# EAGLE design TeensyBreakout (EAGLE 7.3.0)
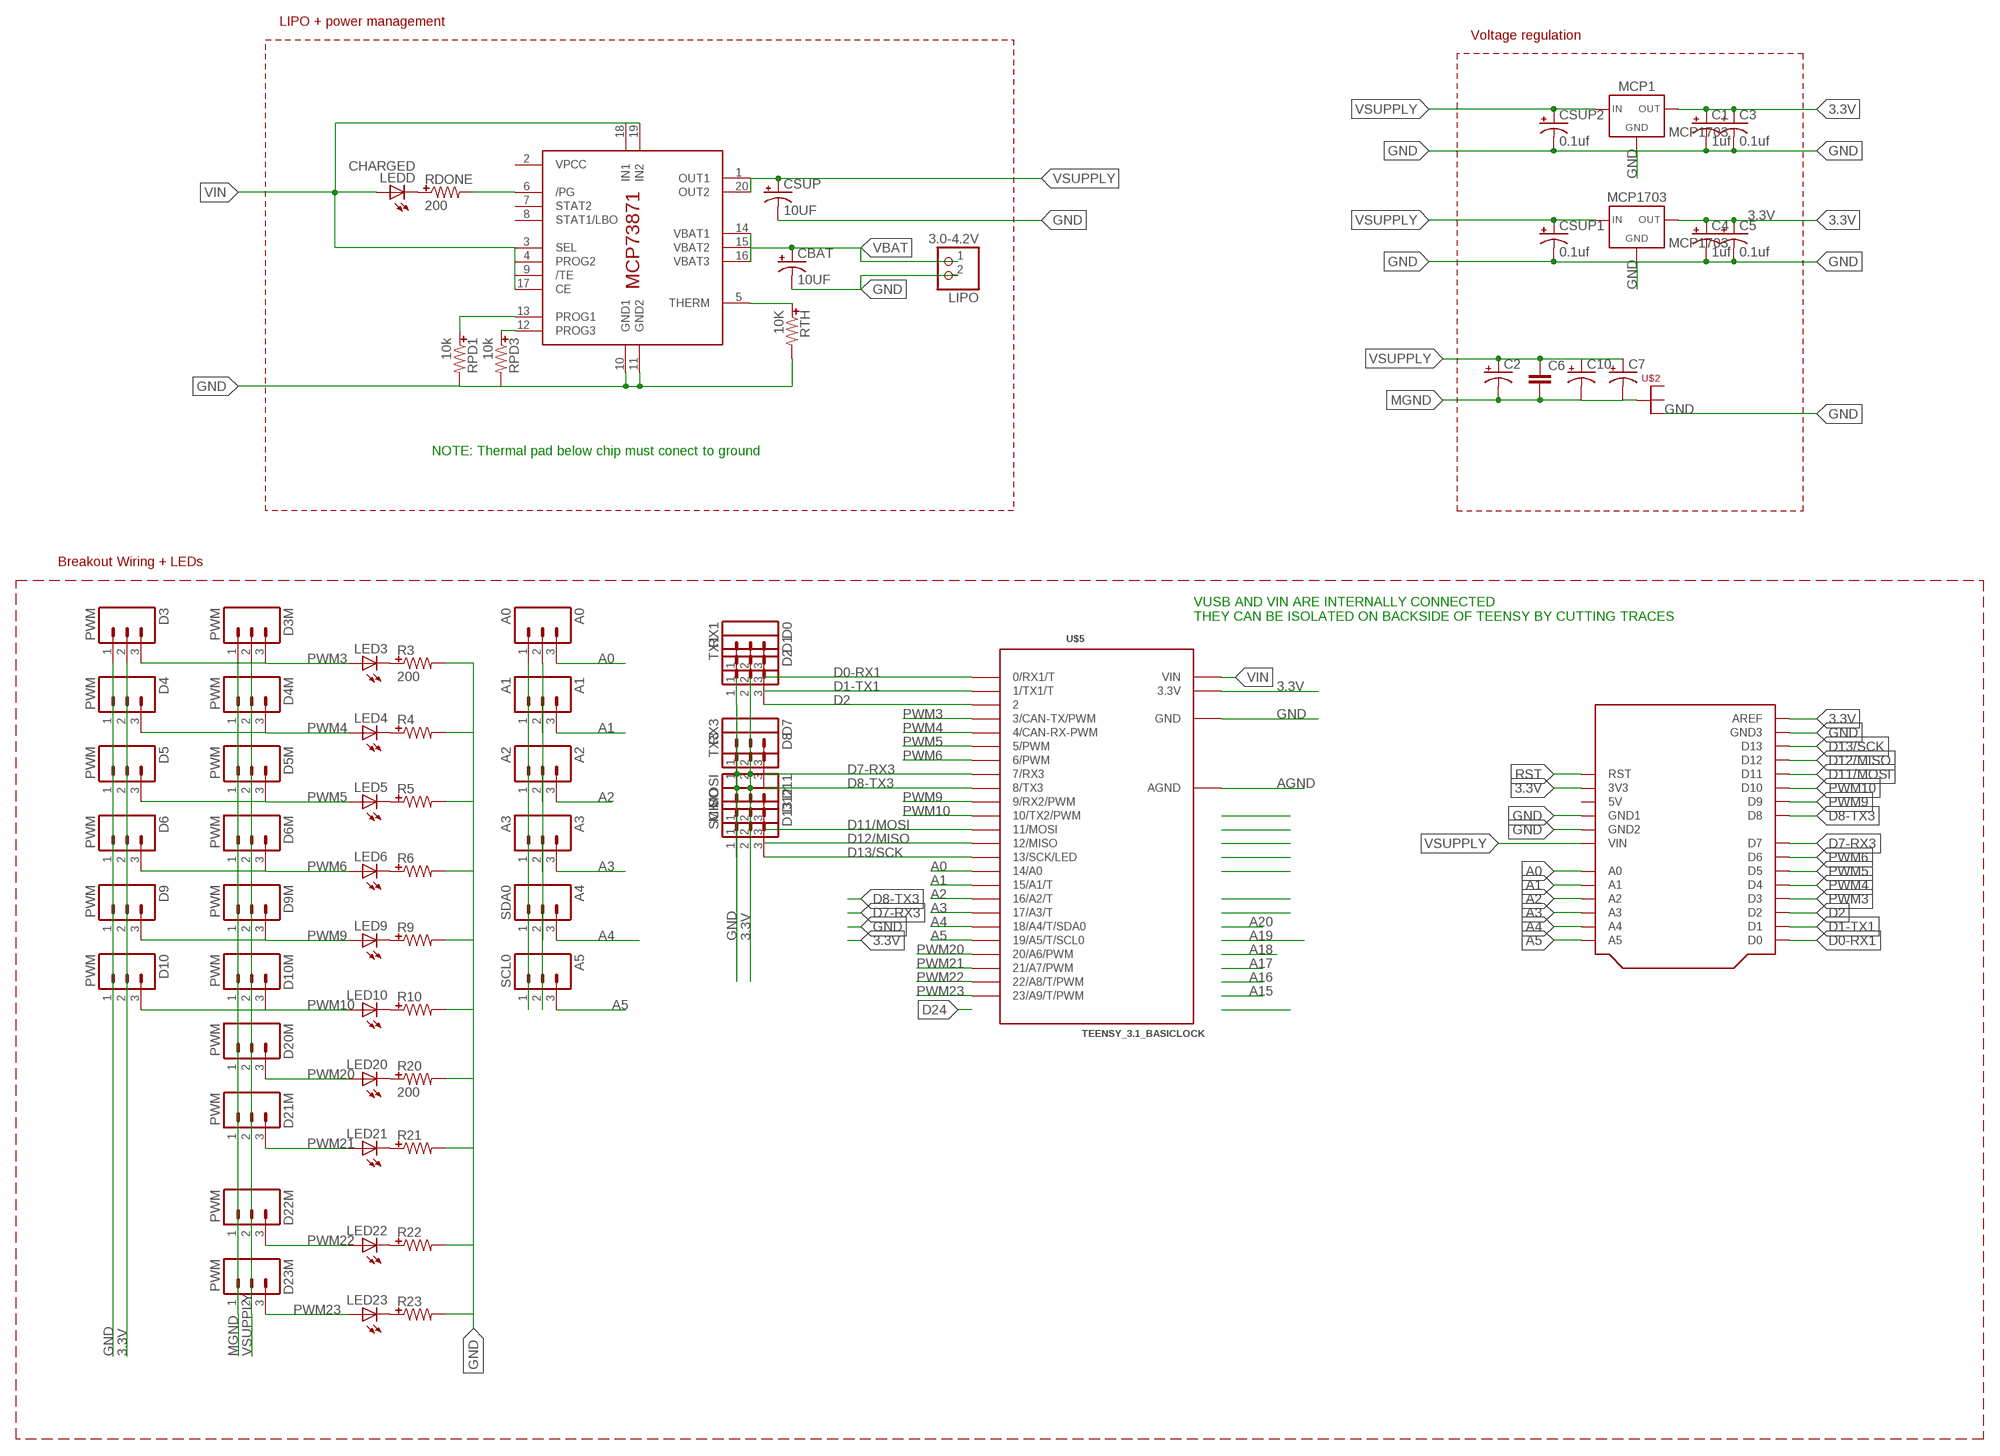
[diagram p0: schematic, sheet 1]

## Parts
A0  A0  M03LOCK  [1X03_LOCK]
A1  A1  M03LOCK  [1X03_LOCK]
A2  A2  M03LOCK  [1X03_LOCK]
A3  A3  M03LOCK  [1X03_LOCK]
A4  SDA0  M03LOCK  [1X03_LOCK]
A5  SCL0  M03LOCK  [1X03_LOCK]
C1  1uf  CAP-POLARIZEDUNIVERSAL  [0402-0603-0805-UNIVERSAL]
C2  CAP-POLARIZEDUNIVERSAL  [0402-0603-0805-UNIVERSAL]
C3  0.1uf  CAP-POLARIZEDUNIVERSAL  [0402-0603-0805-UNIVERSAL]
C4  1uf  CAP-POLARIZEDUNIVERSAL  [0402-0603-0805-UNIVERSAL]
C5  0.1uf  CAP-POLARIZEDUNIVERSAL  [0402-0603-0805-UNIVERSAL]
C6  CAP1210  [1210]
C7  CAP-POLARIZEDUNIVERSAL  [0402-0603-0805-UNIVERSAL]
C10  CAP-POLARIZEDUNIVERSAL  [0402-0603-0805-UNIVERSAL]
CBAT  10UF  CAP-POLARIZEDUNIVERSAL  [0402-0603-0805-UNIVERSAL]
CSUP  10UF  CAP-POLARIZEDUNIVERSAL  [0402-0603-0805-UNIVERSAL]
CSUP1  0.1uf  CAP-POLARIZEDUNIVERSAL  [0402-0603-0805-UNIVERSAL]
CSUP2  0.1uf  CAP-POLARIZEDUNIVERSAL  [0402-0603-0805-UNIVERSAL]
D0  RX1  M03LOCK  [1X03_LOCK]
D1  TX1  M03LOCK  [1X03_LOCK]
D2  M03LOCK  [1X03_LOCK]
D3  PWM  M03LOCK  [1X03_LOCK]
D3M  PWM  M03LOCK  [1X03_LOCK]
D4  PWM  M03LOCK  [1X03_LOCK]
D4M  PWM  M03LOCK  [1X03_LOCK]
D5  PWM  M03LOCK  [1X03_LOCK]
D5M  PWM  M03LOCK  [1X03_LOCK]
D6  PWM  M03LOCK  [1X03_LOCK]
D6M  PWM  M03LOCK  [1X03_LOCK]
D7  RX3  M03LOCK  [1X03_LOCK]
D8  TX3  M03LOCK  [1X03_LOCK]
D9  PWM  M03LOCK  [1X03_LOCK]
D9M  PWM  M03LOCK  [1X03_LOCK]
D10  PWM  M03LOCK  [1X03_LOCK]
D10M  PWM  M03LOCK  [1X03_LOCK]
D11  MOSI  M03LOCK  [1X03_LOCK]
D12  MISO  M03LOCK  [1X03_LOCK]
D13  SCK  M03LOCK  [1X03_LOCK]
D20M  PWM  M03LOCK  [1X03_LOCK]
D21M  PWM  M03LOCK  [1X03_LOCK]
D22M  PWM  M03LOCK  [1X03_LOCK]
D23M  PWM  M03LOCK  [1X03_LOCK]
IC1  MCP73871  [QFN20]
LED3  LEDUNIVERSAL  [0402-0603-0805-UNIVERSAL]
LED4  LEDUNIVERSAL  [0402-0603-0805-UNIVERSAL]
LED5  LEDUNIVERSAL  [0402-0603-0805-UNIVERSAL]
LED6  LEDUNIVERSAL  [0402-0603-0805-UNIVERSAL]
LED9  LEDUNIVERSAL  [0402-0603-0805-UNIVERSAL]
LED10  LEDUNIVERSAL  [0402-0603-0805-UNIVERSAL]
LED20  LEDUNIVERSAL  [0402-0603-0805-UNIVERSAL]
LED21  LEDUNIVERSAL  [0402-0603-0805-UNIVERSAL]
LED22  LEDUNIVERSAL  [0402-0603-0805-UNIVERSAL]
LED23  LEDUNIVERSAL  [0402-0603-0805-UNIVERSAL]
LEDD  CHARGED  LEDUNIVERSAL  [0402-0603-0805-UNIVERSAL]
LIPO  3.0-4.2V  JST_2PIN-THM-RA  [JST-PH-2-THM-RA]
MCP1  MCP1703  VOLTAGE-REGULATORMCP1703  [SOT23]
MCP1703  MCP1703  VOLTAGE-REGULATORMCP1703  [SOT23]
R3  200  RESISTORUNIVERSAL  [0402-0603-0805-UNIVERSAL]
R4  RESISTORUNIVERSAL  [0402-0603-0805-UNIVERSAL]
R5  RESISTORUNIVERSAL  [0402-0603-0805-UNIVERSAL]
R6  RESISTORUNIVERSAL  [0402-0603-0805-UNIVERSAL]
R9  RESISTORUNIVERSAL  [0402-0603-0805-UNIVERSAL]
R10  RESISTORUNIVERSAL  [0402-0603-0805-UNIVERSAL]
R20  200  RESISTORUNIVERSAL  [0402-0603-0805-UNIVERSAL]
R21  RESISTORUNIVERSAL  [0402-0603-0805-UNIVERSAL]
R22  RESISTORUNIVERSAL  [0402-0603-0805-UNIVERSAL]
R23  RESISTORUNIVERSAL  [0402-0603-0805-UNIVERSAL]
RDONE  200  RESISTORUNIVERSAL  [0402-0603-0805-UNIVERSAL]
RPD1  10k  RESISTORUNIVERSAL  [0402-0603-0805-UNIVERSAL]
RPD3  10k  RESISTORUNIVERSAL  [0402-0603-0805-UNIVERSAL]
RTH  10K  RESISTORUNIVERSAL  [0402-0603-0805-UNIVERSAL]
U$2  NET-JUNCTION8-MIL-DIAMETER  [NET-JUNCTION]
U$4  ARDUINO  [ARDUINO]
U$5  TEENSY_3.1_BASICLOCK  [TEENSY_3.1_BASIC_LOCK]

## Nets
3.3V: A0.2 A1.2 A2.2 A3.2 A4.2 A5.2 C1.+ C3.+ C4.+ C5.+ D0.2 D1.2 D2.2 D3.2 D4.2 D5.2 D6.2 D7.2 D8.2 D9.2 D10.2 D11.2 D12.2 D13.2 MCP1.2(OUT) MCP1703.2(OUT) U$4.3V3 U$4.AREF U$5.3.3V
A0: A0.3 U$4.A0 U$5.14/A0
A1: A1.3 U$4.A1 U$5.15/A1(15/A1/T)
A2: A2.3 U$4.A2 U$5.16/A2(16/A2/T)
A3: A3.3 U$4.A3 U$5.17/A3(17/A3/T)
A4: A4.3 U$4.A4 U$5.18/A4(18/A4/T/SDA0)
A5: A5.3 U$4.A5 U$5.19/A5(19/A5/T/SCL0)
AGND: U$5.AGND
D0-RX1: D0.3 U$4.D0 U$5.0(0/RX1/T)
D1-TX1: D1.3 U$4.D1 U$5.1(1/TX1/T)
D2: D2.3 U$4.D2 U$5.2
D7-RX3: D7.3 U$4.D7 U$5.7(7/RX3)
D8-TX3: D8.3 U$4.D8 U$5.8(8/TX3)
D11/MOSI: D11.3 U$4.D11 U$5.11(11/MOSI)
D12/MISO: D12.3 U$4.D12 U$5.12(12/MISO)
D13/SCK: D13.3 U$4.D13 U$5.13(13/SCK/LED)
GND: A0.1 A1.1 A2.1 A3.1 A4.1 A5.1 C1.- C3.- C4.- C5.- CBAT.- CSUP1.- CSUP2.- CSUP.- D0.1 D1.1 D2.1 D3.1 D4.1 D5.1 D6.1 D7.1 D8.1 D9.1 D10.1 D11.1 D12.1 D13.1 IC1.10(GND1) IC1.11(GND2) LIPO.2 MCP1.1(GND) MCP1703.1(GND) R3.- R4.- R5.- R6.- R9.- R10.- R20.- R21.- R22.- R23.- RPD1.- RPD3.- RTH.- U$2.P$4 U$4.GND1 U$4.GND2 U$4.GND3 U$5.GND
MGND: C2.- C6.2 C7.- C10.- D3M.1 D4M.1 D5M.1 D6M.1 D9M.1 D10M.1 D20M.1 D21M.1 D22M.1 D23M.1 U$2.P$1
N$1: IC1.5(THERM) RTH.+
N$2: IC1.12(PROG3) RPD3.+
N$4: IC1.13(PROG1) RPD1.+
N$6: IC1.6(/PG) RDONE.-
N$7: LEDD.-(C) RDONE.+
N$17: LED3.-(C) R3.+
N$18: LED4.-(C) R4.+
N$19: LED5.-(C) R5.+
N$20: LED6.-(C) R6.+
N$21: LED9.-(C) R9.+
N$22: LED10.-(C) R10.+
N$23: LED20.-(C) R20.+
N$24: LED21.-(C) R21.+
N$25: LED22.-(C) R22.+
N$26: LED23.-(C) R23.+
PWM3: D3.3 D3M.3 LED3.+(A) U$4.D3 U$5.3(3/CAN-TX/PWM)
PWM4: D4.3 D4M.3 LED4.+(A) U$4.D4 U$5.4(4/CAN-RX-PWM)
PWM5: D5.3 D5M.3 LED5.+(A) U$4.D5 U$5.5(5/PWM)
PWM6: D6.3 D6M.3 LED6.+(A) U$4.D6 U$5.6(6/PWM)
PWM9: D9.3 D9M.3 LED9.+(A) U$4.D9 U$5.9(9/RX2/PWM)
PWM10: D10.3 D10M.3 LED10.+(A) U$4.D10 U$5.10(10/TX2/PWM)
PWM20: D20M.3 LED20.+(A) U$5.20/A6(20/A6/PWM)
PWM21: D21M.3 LED21.+(A) U$5.21/A7(21/A7/PWM)
PWM22: D22M.3 LED22.+(A) U$5.22/A8(22/A8/T/PWM)
PWM23: D23M.3 LED23.+(A) U$5.23/A9(23/A9/T/PWM)
RST: U$4.RST
VBAT: CBAT.+ IC1.14(VBAT1) IC1.15(VBAT2) IC1.16(VBAT3) LIPO.1
VIN: IC1.3(SEL) IC1.4(PROG2) IC1.9(/TE) IC1.17(CE) IC1.18(IN1) IC1.19(IN2) LEDD.+(A) U$5.VIN
VSUPPLY: C2.+ C6.1 C7.+ C10.+ CSUP1.+ CSUP2.+ CSUP.+ D3M.2 D4M.2 D5M.2 D6M.2 D9M.2 D10M.2 D20M.2 D21M.2 D22M.2 D23M.2 IC1.1(OUT1) IC1.20(OUT2) MCP1.3(IN) MCP1703.3(IN) U$4.VIN
Unconnected: IC1.2(VPCC) IC1.7(STAT2) IC1.8(STAT1/LBO) U$2.P$3 U$2.P$5 U$4.5V

## Notes on the sheet
- LIPO + power management
- Voltage regulation
- NOTE: Thermal pad below chip must conect to ground
- Breakout Wiring + LEDs
- VUSB AND VIN ARE INTERNALLY CONNECTED
  THEY CAN BE ISOLATED ON BACKSIDE OF TEENSY BY CUTTING TRACES

## Library data of the parts
A0 A1-A5 D0 D1-D3 D3M D4 D4M D5 D5M D6 D6M D7-D9 D9M D10 D10M D11-D13 D20M D21M D22M D23M = tekdemo:M03: Header 3 Standard 3-pin 0.1" header. Use with straight break away headers (SKU : PRT-00116), right angle break away headers (PRT-00553), swiss pins (PRT-00743), machine pins (PRT-00117), and female headers (PRT-00115). Molex polarized connector foot print use with SKU : PRT-08232 with associated crimp pins and housings.
C1-C5 C7 C10 CBAT CSUP CSUP1 CSUP2 = tekdemo:CAP-POLARIZED: Capacitor Polarized These are standard SMD and PTH capacitors. Normally 10uF, 47uF, and 100uF in electrolytic and tantalum varieties. Always verify the external diameter of the through hole cap, it varies with capacity, voltage, and manufacturer. The EIA devices should be standard.
C6 = tekdemo:CAP: Capacitor Standard 0603 ceramic capacitor, and 0.1" leaded capacitor.
IC1 = adafruit:MCP73871
LED3-LED6 LED9 LED10 LED20-LED23 LEDD = tekdemo:LED: LEDs Standard schematic elements and footprints for 5mm, 3mm, 1206, and 0603 sized LEDs. 5mm - Spark Fun Electronics SKU : Comp-SBL
LIPO = adafruit:JST_2PIN: JST 2-Pin Connectors of various flavors SMT-RA (S2B-PH-SM4) 4UConnector #17311 SMT (B2B-PH-SM4) THM-RA (S2B-PH) THM (B2B-PH)
MCP1 MCP1703 = tekdemo:VOLTAGE-REGULATOR
R3-R6 R9 R10 R20-R23 RDONE RPD1 RPD3 RTH = tekdemo:RESISTOR: Resistor Basic schematic elements and footprints for 0603, 1206, and PTH resistors.
U$2 = tekdemo:NET-JUNCTION
U$4 = SMDuino:ARDUINO
U$5 = tekdemo:TEENSY_3.1_BASIC: Footprint for Teensy 3.1 board using all pin connections on the outer perimeter

## Board
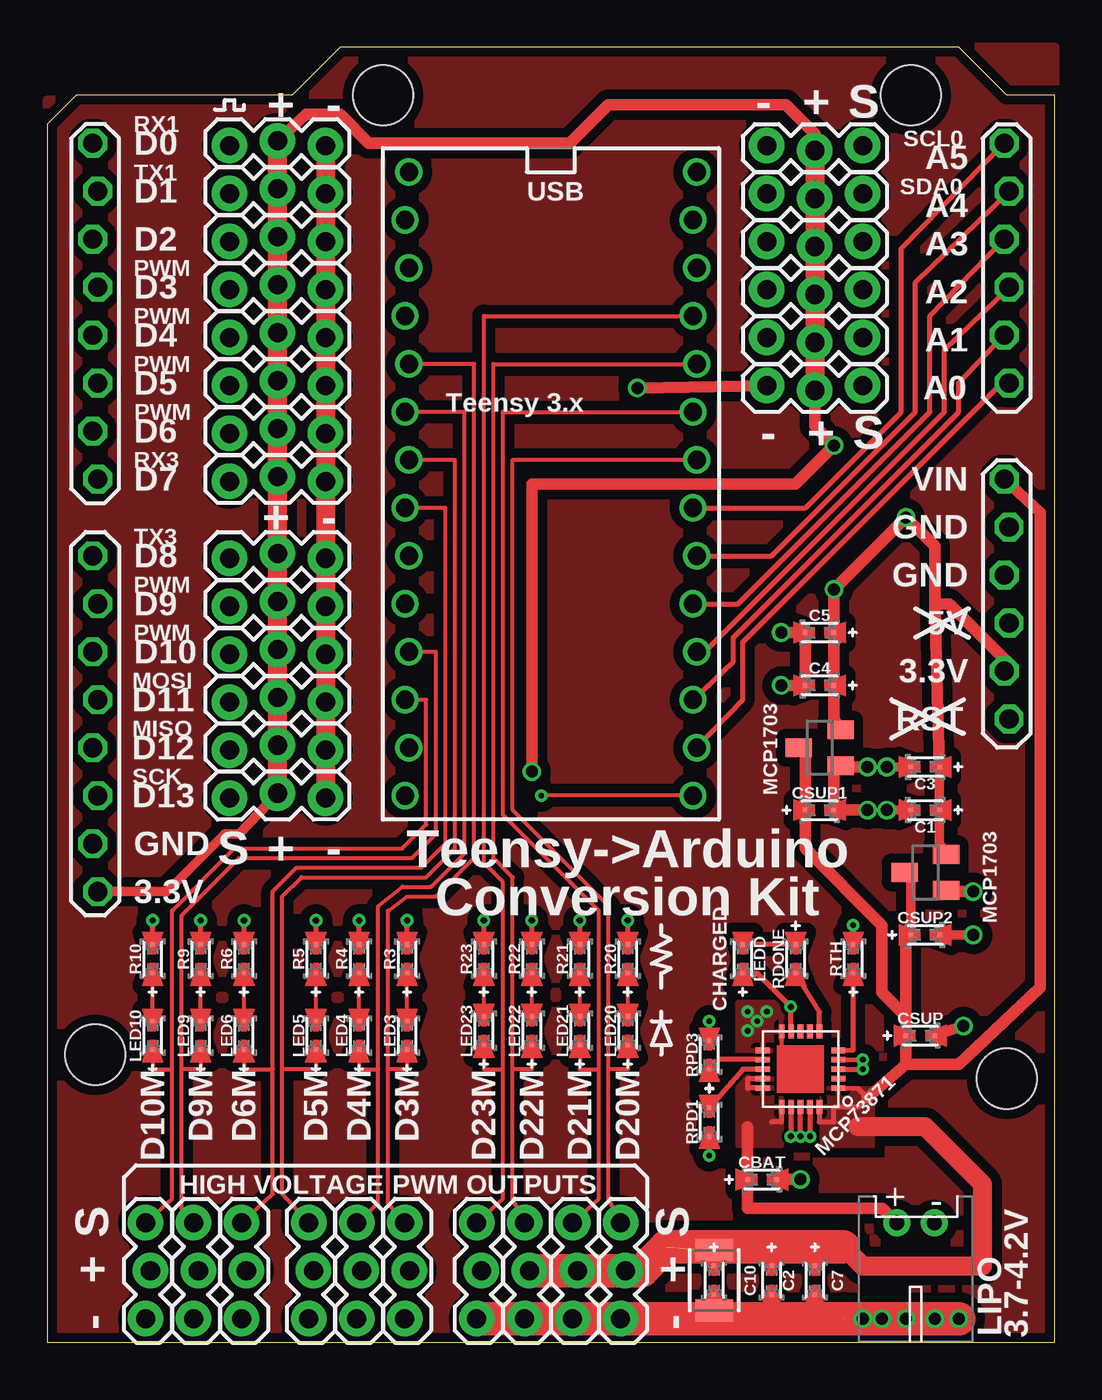
[diagram p1: board, top side]
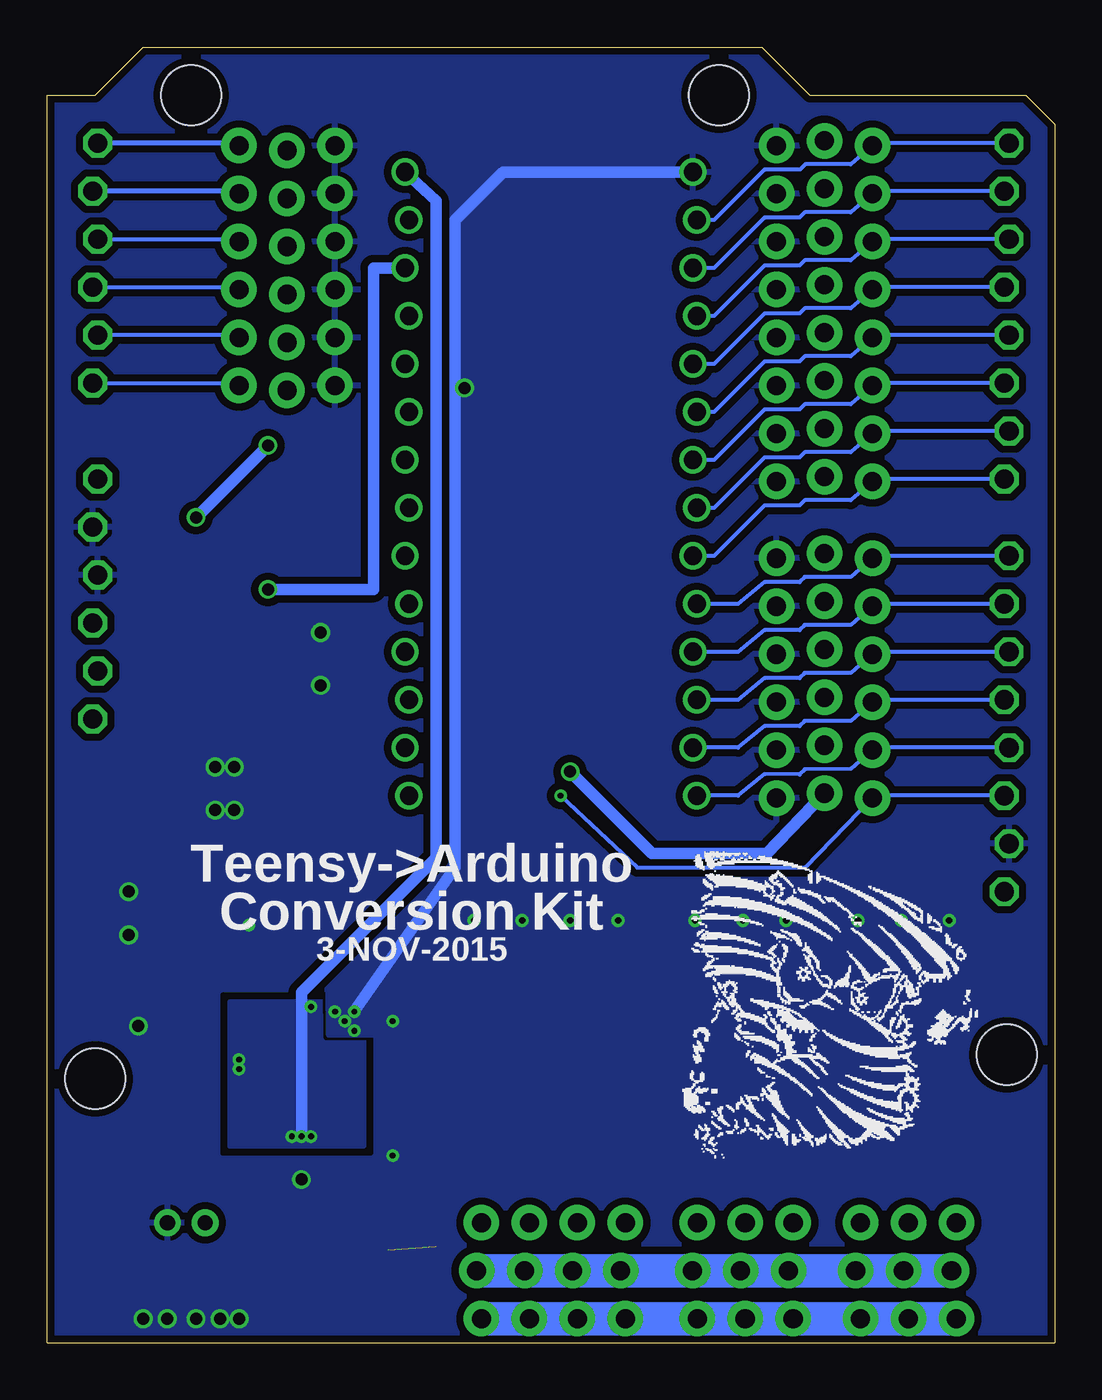
[diagram p2: board, bottom side, seen from below]

Size 53.34 x 68.58 mm. Coordinates in mm from the lower left corner, seen from the top.
Copper layers (1*16): Top 0.0356mm / dielectric 1.5011mm / Bottom 0.0356mm
Design rules "LaenPCBOrder-tented": minimum track width 6mil, minimum drill 13mil, track to track 6mil, track to pad 6mil, pad to pad 6mil, via to via 6mil, smd to smd 0mil, copper to edge 15mil, drill to drill 6mil, minimum pad ring 7mil, minimum via ring 7mil, stop-mask expansion 4mil, vias tented up to drill 25mil, thermal gap 10mil
tKeepout: area 47.6,10.8 to 54,17.1

### Footprints (pad centres in the part's own frame; a part is rotated, then mirrored left to right if it is on the bottom)
1X03_LOCK = drill 1.016 pad 1.88: 1 0,0.127; 2 2.54,-0.127; 3 5.08,0.127
0402-0603-0805-UNIVERSAL = smd 0.254 x 0.254: + -0.762,0; - 0.762,0
1210 = smd 1.2 x 2: 1 -1.6,0; 2 1.6,0
QFN20 = smd 0.75 x 0.3: 1 -2,1; 2 -2,0.5; 3 -2,0; 4 -2,-0.5; 5 -2,-1; 11 2,-1; 12 2,-0.5; 13 2,0; 14 2,0.5; 15 2,1 | smd 0.3 x 0.75: 6 -1,-2; 7 -0.5,-2; 8 0,-2; 9 0.5,-2; 10 1,-2; 16 1,2; 17 0.5,2; 18 0,2; 19 -0.5,2; 20 -1,2
JST-PH-2-THM-RA = drill 0.8 pad 1.422: 1 1,0; 2 -1,0
SOT23 = smd 1 x 1.4: 1 -0.95,-1.1; 2 0.95,-1.1; 3 0,1.1
NET-JUNCTION = smd 0.051 x 0.051: P$1 -0.076,0; P$3 0,0.076; P$4 0.076,0; P$5 0,-0.076
ARDUINO = drill 1.016 octagon: 3V3 35.56,2.667; 5V 38.1,2.413; A0 50.8,2.413; A1 53.34,2.667; A2 55.88,2.413; A3 58.42,2.667; A4 60.96,2.413; A5 63.5,2.667; AREF 23.876,50.673; D0 63.5,50.927; D1 60.96,50.673; D2 58.42,50.927; D3 55.88,50.673; D4 53.34,50.927; D5 50.8,50.673; D6 48.26,50.927; D7 45.72,50.673; D8 41.656,50.927; D9 39.116,50.673; D10 36.576,50.927; D11 34.036,50.673; D12 31.496,50.927; D13 28.956,50.673; GND1 40.64,2.667; GND2 43.18,2.413; GND3 26.416,50.927; RST 33.02,2.413; VIN 45.72,2.667 | hole 3.2: 15.24,50.8; 13.97,2.54; 66.04,35.56; 66.04,7.62
TEENSY_3.1_BASIC_LOCK = drill 0.965: 0 -7.722,13.97; 1 -7.518,11.43; 2 -7.722,8.89; 3 -7.518,6.35; 3.3V 7.722,11.43; 4 -7.722,3.81; 5 -7.518,1.27; 6 -7.722,-1.27; 7 -7.518,-3.81; 8 -7.722,-6.35; 9 -7.518,-8.89; 10 -7.722,-11.43; 11 -7.518,-13.97; 12 -7.722,-16.51; 13 7.518,-16.51; 14/A0 7.722,-13.97; 15/A1 7.518,-11.43; 16/A2 7.722,-8.89; 17/A3 7.518,-6.35; 18/A4 7.722,-3.81; 19/A5 7.518,-1.27; 20/A6 7.722,1.27; 21/A7 7.518,3.81; 22/A8 7.722,6.35; 23/A9 7.518,8.89; AGND 7.518,13.97; GND -7.518,16.51; VIN 7.722,16.51

### Placement (x,y rotation side)
A0  38.1,50.55 0 top
A1  38.1,53.09 0 top
A2  38.1,55.63 0 top
A3  38.1,58.17 0 top
A4  38.1,60.71 0 top
A5  38.1,63.25 0 top
C1  46.48,28.19 180 top
C2  38.35,3.3 270 top
C3  46.48,30.48 180 top
C4  40.89,34.8 180 top
C5  40.89,37.59 180 top
C6  35.31,3.3 270 top
C7  40.64,3.3 270 top
C10  35.31,3.3 270 top
CBAT  37.85,8.64 0 top
CSUP  46.23,16.26 0 top
CSUP1  40.89,28.19 0 top
CSUP2  46.48,21.59 0 top
D0  14.73,63.5 180 top
D1  14.73,60.96 180 top
D2  14.73,58.42 180 top
D3  14.73,55.88 180 top
D3M  19.05,1.27 90 top
D4  14.73,53.34 180 top
D4M  16.51,1.27 90 top
D5  14.73,50.8 180 top
D5M  13.97,1.27 90 top
D6  14.73,48.26 180 top
D6M  10.41,1.27 90 top
D7  14.73,45.72 180 top
D8  14.73,41.66 180 top
D9  14.73,39.12 180 top
D9M  7.87,1.27 90 top
D10  14.73,36.58 180 top
D10M  5.33,1.27 90 top
D11  14.73,34.04 180 top
D12  14.73,31.5 180 top
D13  14.73,28.96 180 top
D20M  30.48,1.27 90 top
D21M  27.94,1.27 90 top
D22M  25.4,1.27 90 top
D23M  22.86,1.27 90 top
IC1  39.88,14.48 180 top
LED3  19.05,16.26 90 top
LED4  16.51,16.26 90 top
LED5  14.22,16.26 90 top
LED6  10.41,16.26 90 top
LED9  8.13,16.26 90 top
LED10  5.59,16.26 90 top
LED20  30.73,16.51 90 top
LED21  28.19,16.51 90 top
LED22  25.65,16.51 90 top
LED23  23.11,16.51 90 top
LEDD  36.83,20.32 90 top
LIPO  45.97,6.35 180 top
MCP1  46.48,24.89 90 top
MCP1703  40.89,31.5 90 top
R3  19.05,20.32 90 top
R4  16.51,20.32 90 top
R5  14.22,20.32 90 top
R6  10.41,20.32 90 top
R9  8.13,20.32 90 top
R10  5.59,20.32 90 top
R20  30.73,20.32 90 top
R21  28.19,20.32 90 top
R22  25.65,20.32 90 top
R23  23.11,20.32 90 top
RDONE  39.62,20.32 270 top
RPD1  35.05,11.68 270 top
RPD3  35.05,15.24 90 top
RTH  42.67,20.32 90 top
U$2  42.16,1.27 0 top
U$4  53.34,0 90 top
U$5  26.67,45.47 0 top

### Tracks (layer width: path | path; a pad name or v marks a point on that pad's centre or on a via)
3.3V  (via drill 0.64)
  Top 0.508: U$4.AREF 6.35,23.88 9.4,26.92 10.16,26.92 D13.2 | MCP1.2 47.24,26.43 C1.+ C3.+ | 41.99,37.34 arc-90 41.66,37.68
  Top 0.61: D0.2 13.72,65.02 15.49,65.02 17.02,63.5 27.69,63.5 29.72,65.53 39.12,65.53 40.64,64.01 A5.2 | 41.99,37.34 C5.+ 41.66,35.14 41.99,34.8 C4.+ 41.66,33.04 MCP1703.2 | 41.66,37.68 v41.66,39.88 v45.47,43.69 46.99,42.16 46.99,39.12 | C3.+ 46.99,39.12 | U$4.3V3 50.8,36.07 47.75,39.12 46.99,39.12 | A0.2 40.64,48.51 v41.66,47.5 39.62,45.47 25.65,45.47 v25.65,30.23
  Top 1.016: D13.2 D12.2 D11.2 D10.2 D9.2 D8.2 D7.2 D6.2 D5.2 D4.2 D3.2 D2.2 D1.2 D0.2 | A5.2 A4.2 A3.2 A2.2 A1.2 A0.2
  Bottom 0.61: U$5.3.3V 36.07,56.9 36.07,39.88 v41.66,39.88 | v25.65,30.23 21.34,25.91 15.24,25.91 D13.2 | v45.47,43.69 v41.66,47.5
A0
  Top 0.254: U$5.14/A0 36.83,34.04 36.83,37.08 50.55,50.8 U$4.A0
  Bottom 0.203: U$4.A0 43.69,50.8 A0.3
A1
  Top 0.254: U$5.15/A1 36.32,36.07 36.32,37.34 48.26,49.28 48.26,50.8 U$4.A1
  Bottom 0.203: A1.3 43.69,53.34 U$4.A1
A2
  Top 0.254: U$5.16/A2 34.8,36.58 47.5,49.28 47.5,52.58 U$4.A2
  Bottom 0.203: U$4.A2 43.69,55.88 A2.3
A3
  Top 0.254: U$5.17/A3 36.58,39.12 46.74,49.28 46.74,54.36 U$4.A3
  Bottom 0.203: U$4.A3 43.69,58.42 A3.3
A4
  Top 0.254: U$5.18/A4 38.35,41.66 45.97,49.28 45.97,56.13 U$4.A4
  Bottom 0.254: A4.3 43.69,60.96 U$4.A4
A5
  Top 0.254: U$5.19/A5 40.13,44.2 45.21,49.28 45.21,57.91 U$4.A5
  Bottom 0.254: A5.3 43.69,63.5 U$4.A5
D0-RX1
  Bottom 0.203: U$4.D0 8.89,63.5 D0.3 10.79,62.38 13.21,62.38 13.49,62.1 15.37,62.1 18.03,59.44 U$5.0
D1-TX1
  Bottom 0.203: U$4.D1 8.89,60.96 D1.3 10.79,59.84 13.23,59.84 13.51,59.56 15.37,59.56 18.03,56.9 U$5.1
D2
  Bottom 0.203: U$4.D2 8.89,58.42 D2.3 10.79,57.3 13.23,57.3 13.51,57.02 15.37,57.02 18.03,54.36 U$5.2
D7-RX3
  Bottom 0.203: U$4.D7 8.89,45.72 D7.3 10.79,44.6 13.23,44.6 13.51,44.32 15.37,44.32 18.03,41.66 U$5.7
D8-TX3
  Bottom 0.203: U$4.D8 8.89,41.66 D8.3 10.79,40.54 13.23,40.54 13.51,40.26 15.37,40.26 16.76,39.12 U$5.8
D11/MOSI
  Bottom 0.203: U$4.D11 8.89,34.04 D11.3 10.79,32.92 13.23,32.92 13.51,32.64 15.37,32.64 16.76,31.5 U$5.11
D12/MISO
  Bottom 0.203: U$4.D12 8.89,31.5 D12.3 10.79,30.38 13.23,30.35 13.51,30.07 15.37,30.1 16.76,28.96 U$5.12
D13/SCK  (via drill 0.3)
  Top 0.203: U$5.13 v26.16,28.96
  Bottom 0.203: U$4.D13 8.89,28.96 D13.3 13.21,25.15 22.1,25.15 v26.16,28.96
GND  (via drill 0.3, 0.33, 0.64)
  Top 0.203: IC1.10 38.88,15.49
  Top 0.254: RTH.- v42.67,22.1 | RPD1.- v35.05,9.91 | RPD3.- v35.05,17.02 | R20.- v30.73,22.35 | R21.- v28.19,22.35 | R22.- v25.65,22.35 | R23.- v23.11,22.35 | R3.- v19.05,22.35 | R4.- v16.51,22.35 | R5.- v14.22,22.35 | R6.- v10.41,22.35 | R9.- v8.13,22.35 | R10.- v5.59,22.35
  Top 0.508: CSUP2.- v49.02,21.59 | MCP1.1 arc90 47.65,23.88 | C1.- v44.45,28.19 | C3.- v44.45,30.48
  Top 0.61: CBAT.- v39.88,8.64 | CSUP.- v48.51,16.76 | 41.66,30.55 CSUP1.- v43.43,28.19 | 41.66,30.55 MCP1703.1 | 41.66,30.55 arc90 41.72,30.48 v43.43,30.48 | v38.86,34.8 C4.- C5.- v38.86,37.59 | A0.1 v31.24,50.55 | 47.65,23.88 v49.02,23.88
  Top 1.016: D0.1 D1.1 D2.1 D3.1 D4.1 D5.1 D6.1 D7.1 D8.1 D9.1 D10.1 D11.1 D12.1 D13.1
  Top 1.778: v48.26,1.27 v46.99,1.27 v45.47,1.27 v44.2,1.27 v43.18,1.27 U$2.P$4
  Bottom 0.61: U$5.GND 29.21,61.98 31.75,59.44 31.75,25.15 v37.08,17.53
  other vias: 38.1,17.53 37.08,16.51 37.59,17.02
  pour Bottom (isolate 0.381, rank 6): 53.34,0 53.34,68.83 0,68.83 0,0
  pour Top (isolate 0.203): 39.24,15.21 36.58,15.24 36.58,18.03 39.19,18.03
  pour Bottom (isolate 0.381): 38.48,18.82 35.81,18.8 35.81,16.26 38.43,16.26
MGND
  Top 0.254: C10.- C6.2 35.31,1.27 | C2.- 38.35,1.27 | C7.- 40.64,1.27
  Top 1.778: U$2.P$1 40.64,1.27 38.35,1.27 35.31,1.27 D20M.1 D21M.1 D22M.1 D23M.1
  Bottom 1.778: D10M.1 D9M.1 D6M.1 D5M.1 D4M.1 D3M.1 D23M.1 D22M.1 D21M.1 D20M.1
N$1
  Top 0.254: IC1.5 42.67,15.49 RTH.+
N$2
  Top 0.254: IC1.12 35.56,14.99 RPD3.+
N$3
  pour Top (isolate 0.508, rank 6): 0,-0.25 0,65.79 12.7,65.79 15.49,68.58 53.34,68.58 53.34,-0.25
N$4
  Top 0.254: IC1.13 36.83,14.48 RPD1.+
N$6
  Top 0.254: IC1.6 40.89,17.51 RDONE.-
N$7
  Top 0.254: RDONE.+ LEDD.-
N$17
  Top 0.203: LED3.- R3.+
N$18
  Top 0.203: LED4.- R4.+
N$19
  Top 0.203: LED5.- R5.+
N$20
  Top 0.203: LED6.- R6.+
N$21
  Top 0.203: LED9.- R9.+
N$22
  Top 0.203: LED10.- R10.+
N$23
  Top 0.203: LED20.- R20.+
N$24
  Top 0.203: LED21.- R21.+
N$25
  Top 0.203: LED22.- R22.+
N$26
  Top 0.203: LED23.- R23.+
PWM3
  Top 0.203: D3M.3 18.03,7.37 18.03,14.48 | 18.03,14.48 18.03,22.86 19.05,23.62 20.57,23.62 22.61,25.65 22.61,51.82 U$5.3 | LED3.+ 19.05,14.48 18.03,14.48
  Bottom 0.203: U$4.D3 8.89,55.88 D3.3 10.79,54.76 13.23,54.76 13.51,54.48 15.37,54.48 18.03,51.82 U$5.3
PWM4
  Top 0.203: D4M.3 17.53,7.37 17.53,14.48 | 17.53,14.48 17.53,23.11 18.8,24.13 20.32,24.13 22.1,25.91 22.1,49.28 U$5.4 | LED4.+ 16.51,14.48 17.53,14.48
  Bottom 0.203: U$4.D4 8.89,53.34 D4.3 10.79,52.22 13.23,52.22 13.51,51.94 15.37,51.94 18.03,49.28 U$5.4
PWM5
  Top 0.203: D5M.3 12.45,7.87 12.45,14.48 | 12.45,14.48 12.45,23.62 13.46,24.64 20.07,24.64 21.59,26.16 21.59,46.74 U$5.5 | LED5.+ 14.22,14.48 12.45,14.48
  Bottom 0.203: U$4.D5 8.89,50.8 D5.3 10.79,49.68 13.23,49.68 13.51,49.4 15.37,49.4 18.03,46.74 U$5.5
PWM6
  Top 0.203: D6M.3 11.94,7.87 11.94,14.48 | 11.94,14.48 11.94,23.88 13.21,25.15 19.81,25.15 21.08,26.42 21.08,44.2 U$5.6 | LED6.+ 10.41,14.48 11.94,14.48
  Bottom 0.203: U$4.D6 8.89,48.26 D6.3 10.79,47.14 13.23,47.14 13.51,46.86 15.37,46.86 18.03,44.2 U$5.6
PWM9
  Top 0.203: D9M.3 7.11,7.11 7.11,14.48 | 7.11,14.48 7.11,22.61 10.16,25.65 19.3,25.65 20.57,26.92 20.57,36.58 U$5.9 | LED9.+ 8.13,14.48 7.11,14.48
  Bottom 0.203: U$4.D9 8.89,39.12 D9.3 10.79,38 13.23,38 13.51,37.72 15.37,37.72 16.76,36.58 U$5.9
PWM10
  Top 0.203: D10M.3 6.6,7.62 6.6,14.48 | 6.6,14.48 6.6,22.86 9.91,26.16 18.8,26.16 20.07,27.43 20.07,34.04 U$5.10 | LED10.+ 5.59,14.48 6.6,14.48
  Bottom 0.203: U$4.D10 8.89,36.58 D10.3 10.79,35.46 13.23,35.46 13.51,35.18 15.37,35.18 16.76,34.04 U$5.10
PWM20
  Top 0.203: U$5.20/A6 24.64,46.74 24.64,28.19 29.72,23.11 29.72,14.48 | D20M.3 29.72,7.62 29.72,14.48 | LED20.+ 30.73,14.48 29.72,14.48
PWM21
  Top 0.203: D21M.3 29.21,7.62 29.21,14.48 | 29.21,14.48 29.21,22.86 24.13,27.94 24.13,49.28 U$5.21/A7 | LED21.+ 28.19,14.48 29.21,14.48
PWM22
  Top 0.203: D22M.3 24.64,7.62 24.64,14.48 | 24.64,14.48 24.64,24.64 23.62,25.65 23.62,51.82 U$5.22/A8 | LED22.+ 25.65,14.48 24.64,14.48
PWM23
  Top 0.203: D23M.3 24.13,7.62 24.13,14.48 | 24.13,14.48 24.13,24.38 23.11,25.4 23.11,54.36 U$5.23/A9 | LED23.+ 23.11,14.48 24.13,14.48
VBAT
  Top 0.254: IC1.16 38.88,11.68 38.35,11.68 | IC1.14 37.08,13.98 37.08,13.48 | IC1.15 37.08,13.48 | 37.08,13.48 37.08,13.46
  Top 0.61: LIPO.1 44.21,7.11 37.08,7.11 CBAT.+ 37.08,11.43
  pour Top: 36.58,10.41 36.58,14.22 38.86,14.22 38.86,10.41
VIN  (via drill 0.3)
  Top 0.254: v39.88,10.92 IC1.18 | IC1.17 v39.37,10.92 | IC1.19 v40.39,10.92 | IC1.9 v39.37,17.78 37.59,19.56 LEDD.+ | IC1.3 v43.18,14.48 | IC1.4 v43.18,14.99
  Top 0.508: v39.37,10.92 v40.39,10.92
  Bottom 0.254: v39.37,10.92 v39.88,10.92 v40.39,10.92
  Bottom 0.61: U$5.VIN 32.77,60.45 32.77,25.65 39.88,18.54 v39.88,10.92
  pour Bottom (rank 2): 36.58,10.41 36.58,18.03 43.69,18.03 43.69,10.41
VSUPPLY  (1 unrouted)
  Top 0.254: IC1.1 42.93,13.46 43.43,12.95 42.96,12.48 41.66,12.48 41.66,11.68 40.88,11.68 IC1.20 | C10.+ C6.1 | C2.+ 38.35,5.08 | C7.+ 40.64,5.08
  Top 0.508: CSUP2.+ 45.72,24.89 MCP1.3
  Top 0.61: 43.43,12.95 45.47,14.73 | 45.47,14.73 CSUP.+ 45.47,17.27 | MCP1703.3 40.13,31.5 CSUP1.+ 40.13,26.16 44.2,22.1 44.2,18.54 45.47,17.27 | U$4.VIN 52.58,43.94 52.58,18.8 48.26,14.73 45.47,14.73 | 45.47,17.27 45.47,21.34 CSUP2.+
  Top 1.016: 42.16,5.08 43.18,4.06 49.53,4.06 49.53,8.38 46.48,11.43 42.93,11.43
  Top 1.778: 42.16,5.08 40.64,5.08 38.35,5.08 32.77,5.08 31.5,3.81 D20M.2 D21M.2 D22M.2
  Bottom 1.778: D10M.2 D9M.2 D6M.2 D5M.2 D4M.2 D3M.2 D23M.2 D22M.2 D21M.2 D20M.2
  pour Top: 43.69,10.41 41.05,10.41 41.05,13.46 43.69,13.46

### Text on the board
tPlace: + | - | - | + | S | USB | Teensy 3.x | - | + | S | + | - | S | + | - | Teensy->Arduino / Conversion Kit | HIGH VOLTAGE PWM OUTPUTS | S | S | + | + | - | -
bPlace: Teensy->Arduino / Conversion Kit | 3-NOV-2015
tNames: VIN | GND | GND | 5V | 3.3V | RST | GND | 3.3V